# EAGLE design ATtiny10Thermometer (EAGLE 7.6.0)

## Sheet 1 of 2
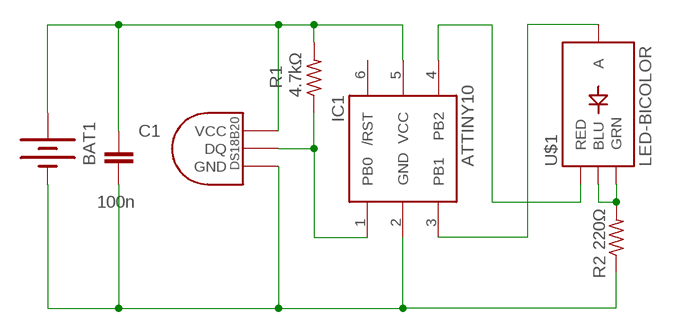
[diagram p0: schematic, sheet 1]

### Parts
BAT1  BATTERY12MM  [BATTCON_12MM]
C1  100n  CAP0603-CAP  [0603-CAP]
IC1  ATTINY10  [SOT23-6]
R1  4.7kΩ  R-US_R0805  [R0805]
R2  220Ω  R-US_R0805  [R0805]
U$1  LED-BICOLOR  LED-TRICOLOR  [LED-TRICOLOR-SMD]
U$2  DS1820  [µSOP8]

### Nets
N$1: BAT1.PWR@1(+) C1.1 IC1.5(VCC) R1.2 U$2.8(VCC)
N$2: IC1.1(PB0) R1.1 U$2.1(DQ)
N$3: R2.2 U$1.B(BLU) U$1.G(GRN)
N$4: IC1.4(PB2) U$1.R(RED)
N$5: IC1.3(PB1) U$1.A
N$8: BAT1.GND(-) C1.2 IC1.2(GND) R2.1 U$2.4(GND)
Unconnected: IC1.6(/RST)

## Sheet 2 of 2

## Library data of the parts
BAT1 = SparkFun-Electromechanical:BATTERY: Battery Holders Various common sizes : AA, AAA, 18650 (PRT-12895), 20mm coin cell and 12mm coin cell. 20MM_4LEGS, BATT-10373; PROD_ID: BATT-08044
C1 = SparkFun-Capacitors:CAP: Capacitor Standard 0603 ceramic capacitor, and 0.1" leaded capacitor.
IC1 = adafruit:ATTINY10: ATtiny4/5/9/10 8-bit Microcontroller with 512/1024 Bytes In-System Programmable Flash
R1 R2 = adafruit:R-US_: RESISTOR, American symbol
U$1 = SparkFun-LED:LED-TRICOLOR: Tri-Color LED SMD Proven layout and schematic for triple color LED in SMD package - common anode. Spark Fun Electronics SKU : COM-07844
U$2 = Ava:DS1820: DS18B20 Programmable Resolution 1-Wire Digital Thermometer Description The DS18B20 digital thermometer provides 9-bit to 12-bit Celsius temperature measurements and has an alarm function with nonvolatile user-programmable upper and lower trigger points. The DS18B20 communicates over a 1-Wire® bus that by definition requires only one data line (and ground) for communication with a central microprocessor. It has an operating temperature range of -55°C to +125°C and is accurate to ±0.5°C over the range of -10°C to +85°C. In addition, the DS18B20 can derive power directly from the data line ("parasite power"), eliminating the need for an external power supply. Each DS18B20 has a unique 64-bit serial code, which allows multiple DS18B20s to function on the same 1-Wire bus. Thus, it is simple to use one microprocessor to control many DS18B20s distributed over a large area. Applications that can benefit from this feature include HVAC environmental controls, temperature monitoring systems inside buildings, equipment, or machinery, and process monitoring and control systems.

## Board
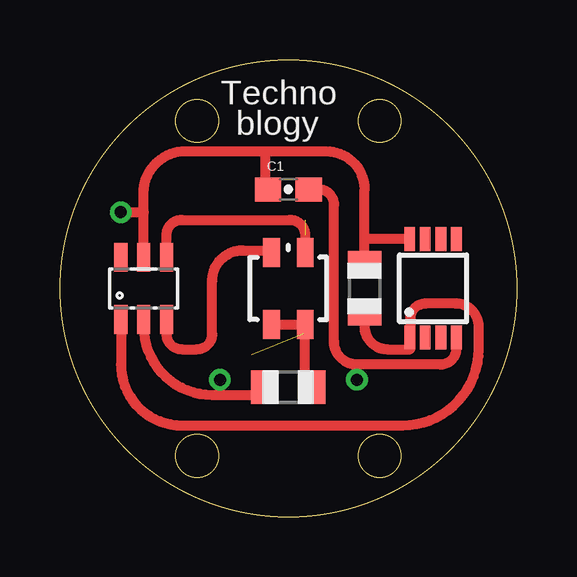
[diagram p1: board, top side]
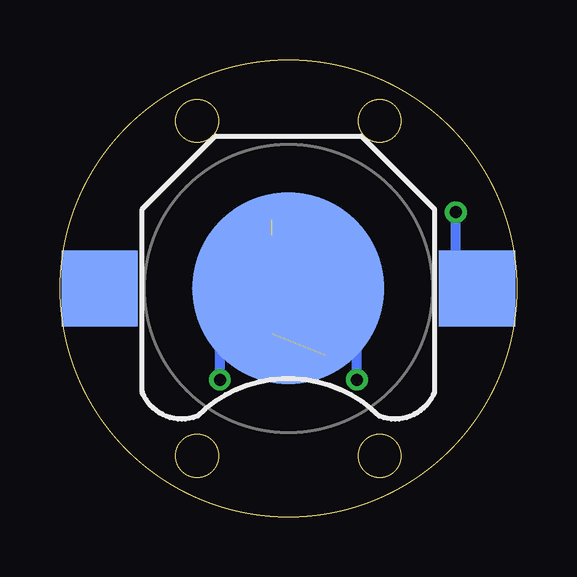
[diagram p2: board, bottom side, seen from below]

Size 19.05 x 19.05 mm. Coordinates in mm from the lower left corner, seen from the top.
Outline: circle at 9.53,9.53 radius 9.53
Outline: circle at 5.71,16.51 radius 0.9
Outline: circle at 13.34,16.51 radius 0.9
Outline: circle at 13.34,2.54 radius 0.9
Outline: circle at 5.71,2.54 radius 0.9
Copper layers (1*16): Top 0.035mm / dielectric 1.5mm / Bottom 0.035mm
Design rules "default *": minimum track width 10mil, minimum drill 24mil, track to track 8mil, track to pad 8mil, pad to pad 8mil, via to via 8mil, smd to smd 8mil, copper to edge 40mil, drill to drill 8mil, minimum pad ring 10mil, minimum via ring 8mil, stop-mask expansion 4mil, vias tented up to drill 20mil, thermal gap 10mil

### Footprints (pad centres in the part's own frame; a part is rotated, then mirrored left to right if it is on the bottom)
BATTCON_12MM = smd 8 x 8: GND 0,0 | smd 3.175 x 3.175: PWR@1 -7.874,0; PWR@2 7.874,0
0603-CAP = smd 1.1 x 1: 1 -0.85,0; 2 0.85,0
SOT23-6 = smd 0.55 x 1.2: 1 -0.95,-1.3; 2 0,-1.3; 3 0.95,-1.3; 4 0.95,1.3; 5 0,1.3; 6 -0.95,1.3
R0805 = smd 1.1 x 1.4: 1 -1,0; 2 1,0
LED-TRICOLOR-SMD = smd 0.7 x 1.2: A 0.7,-1.5; B 0.7,1.5; G -0.7,1.5; R -0.7,-1.5
µSOP8 = smd 0.45 x 1: 1 -0.975,-2.05; 2 -0.325,-2.05; 3 0.325,-2.05; 4 0.975,-2.05; 5 0.975,2.05; 6 0.325,2.05; 7 -0.325,2.05; 8 -0.975,2.05

### Placement (x,y rotation side)
BAT1  9.53,9.53 180 bottom
C1  9.53,13.65 0 top
IC1  3.49,9.53 0 top
R1  12.7,9.53 90 top
R2  9.53,5.4 0 top
U$1  9.53,9.53 180 top
U$2  15.56,9.53 0 top

### Tracks (layer width: path | path; a pad name or v marks a point on that pad's centre or on a via)
N$1  (via drill 0.5)
  Top 0.406: IC1.5 3.49,12.7 | 3.49,12.7 3.49,13.65 arc-90 5.4,15.24 8.57,15.24 | 12.7,11.57 12.7,13.65 arc90 11.11,15.24 8.57,15.24 | v2.54,12.7 3.49,12.7 | U$2.8 12.7,11.57 | 12.7,10.21 R1.2 12.7,11.57 | C1.1 8.57,13.97 8.57,15.24
  Bottom 0.406: BAT1.PWR@1 2.54,9.53 v2.54,12.7
N$2
  Top 0.406: IC1.1 2.54,6.35 arc90 5.08,3.81 14.29,3.81 arc90 17.46,6.99 17.46,7.94 arc90 16.51,8.89 15.24,8.89 arc90 14.61,8.26 14.61,7.5 arc-90 U$2.1 14.61,7.47 14.61,6.99 13.65,6.99 arc-90 12.7,7.94 R1.1
N$3  (1 unrouted)
  Top 0.406: U$1.B U$1.G | R2.2 10.22,6.03 U$1.G | U$1.G 10.16,8.03 10.16,7.62
N$4  (1 unrouted)
  Top 0.406: U$1.R 10.22,11.75 arc90 9.59,12.38 5.08,12.38 arc90 4.44,11.74 IC1.4
N$5
  Top 0.406: IC1.3 4.44,7.62 arc90 5.08,6.99 5.71,6.99 arc90 6.35,7.62 6.35,9.84 arc-90 7.62,11.11 8.74,11.11 arc-90 U$1.A
N$8  (via drill 0.5)
  Top 0.406: 8.57,5.08 R2.1 8.53,5.08 6.67,5.08 | v12.38,5.71 12.38,6.35 | 16.51,7.47 U$2.4 16.53,7.01 arc-90 15.88,6.35 12.38,6.35 | 6.67,5.08 v6.67,5.71 | IC1.2 3.49,7.94 arc90 6.35,5.08 6.67,5.08 | 12.38,6.35 arc-90 11.43,7.3 11.43,13.02 arc90 10.79,13.65 C1.2
  Bottom 0.406: 13.34,9.53 BAT1.GND 9.53,8.89 | v6.67,5.71 6.67,8.89 9.53,8.89 | v12.38,5.71 12.38,7.94 9.53,7.94 9.53,8.89

### Text on the board
tPlace: Techno | blogy